# EAGLE board OOBDpiCAN (EAGLE 7.2.0)
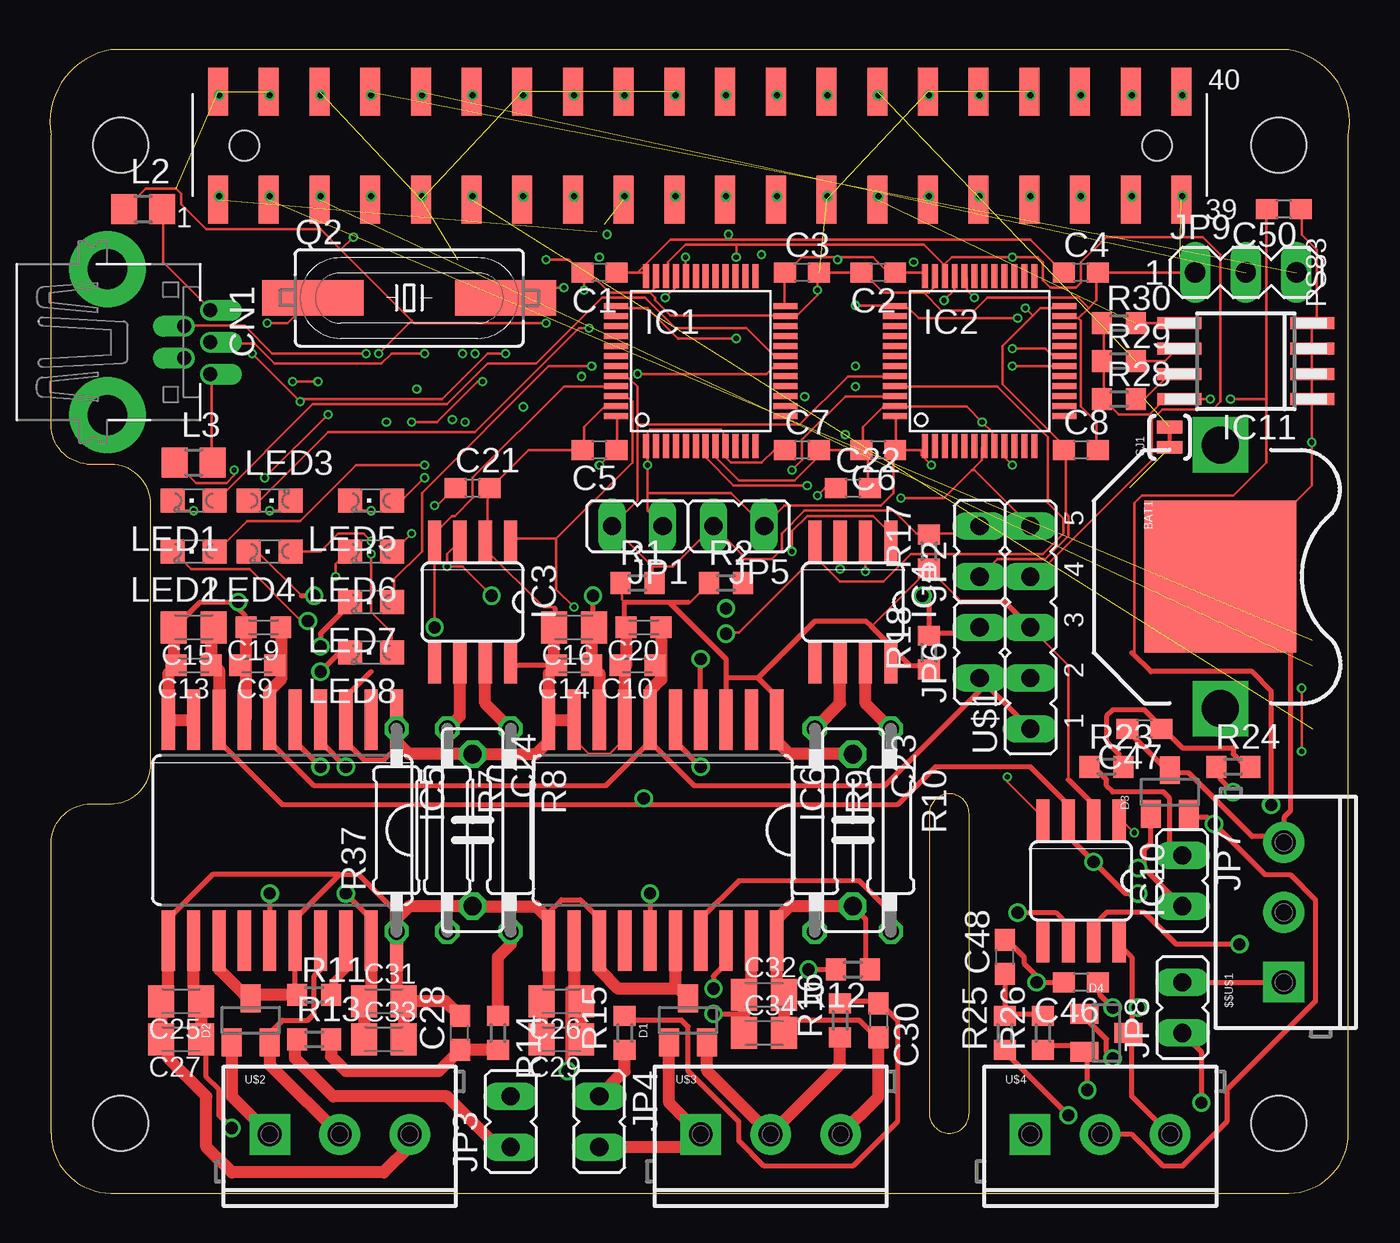
[diagram p3: board, top side]
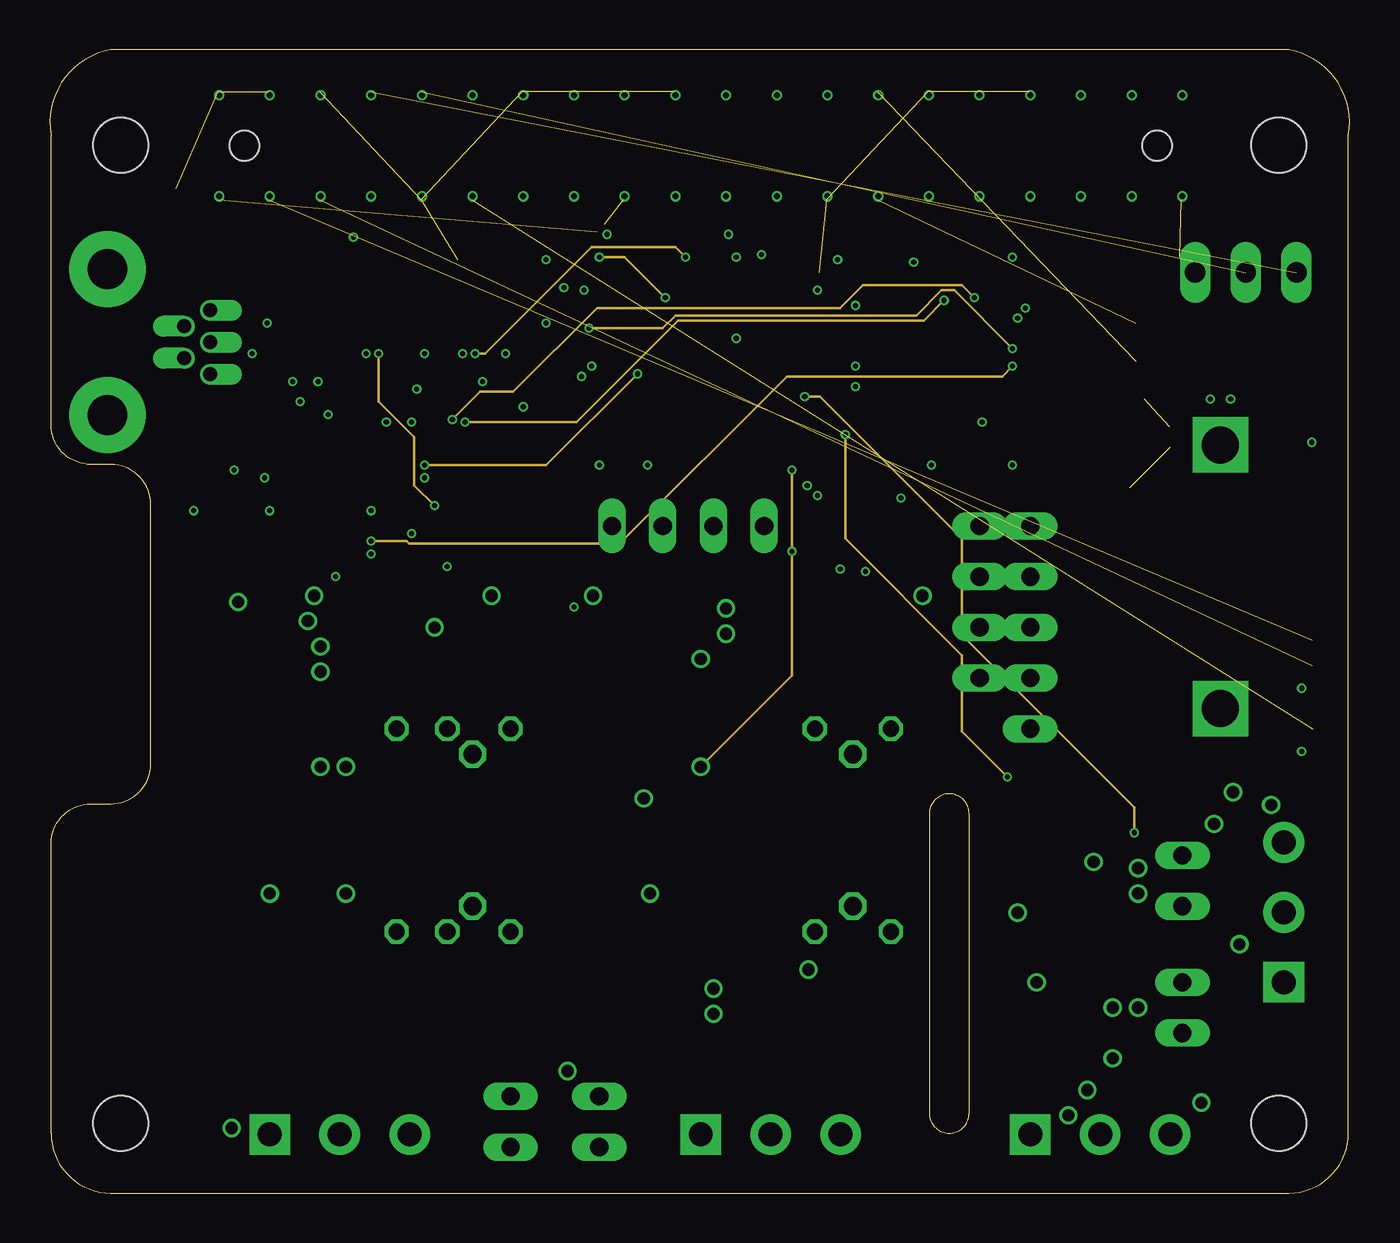
[diagram p4: board, inner layer Route2]
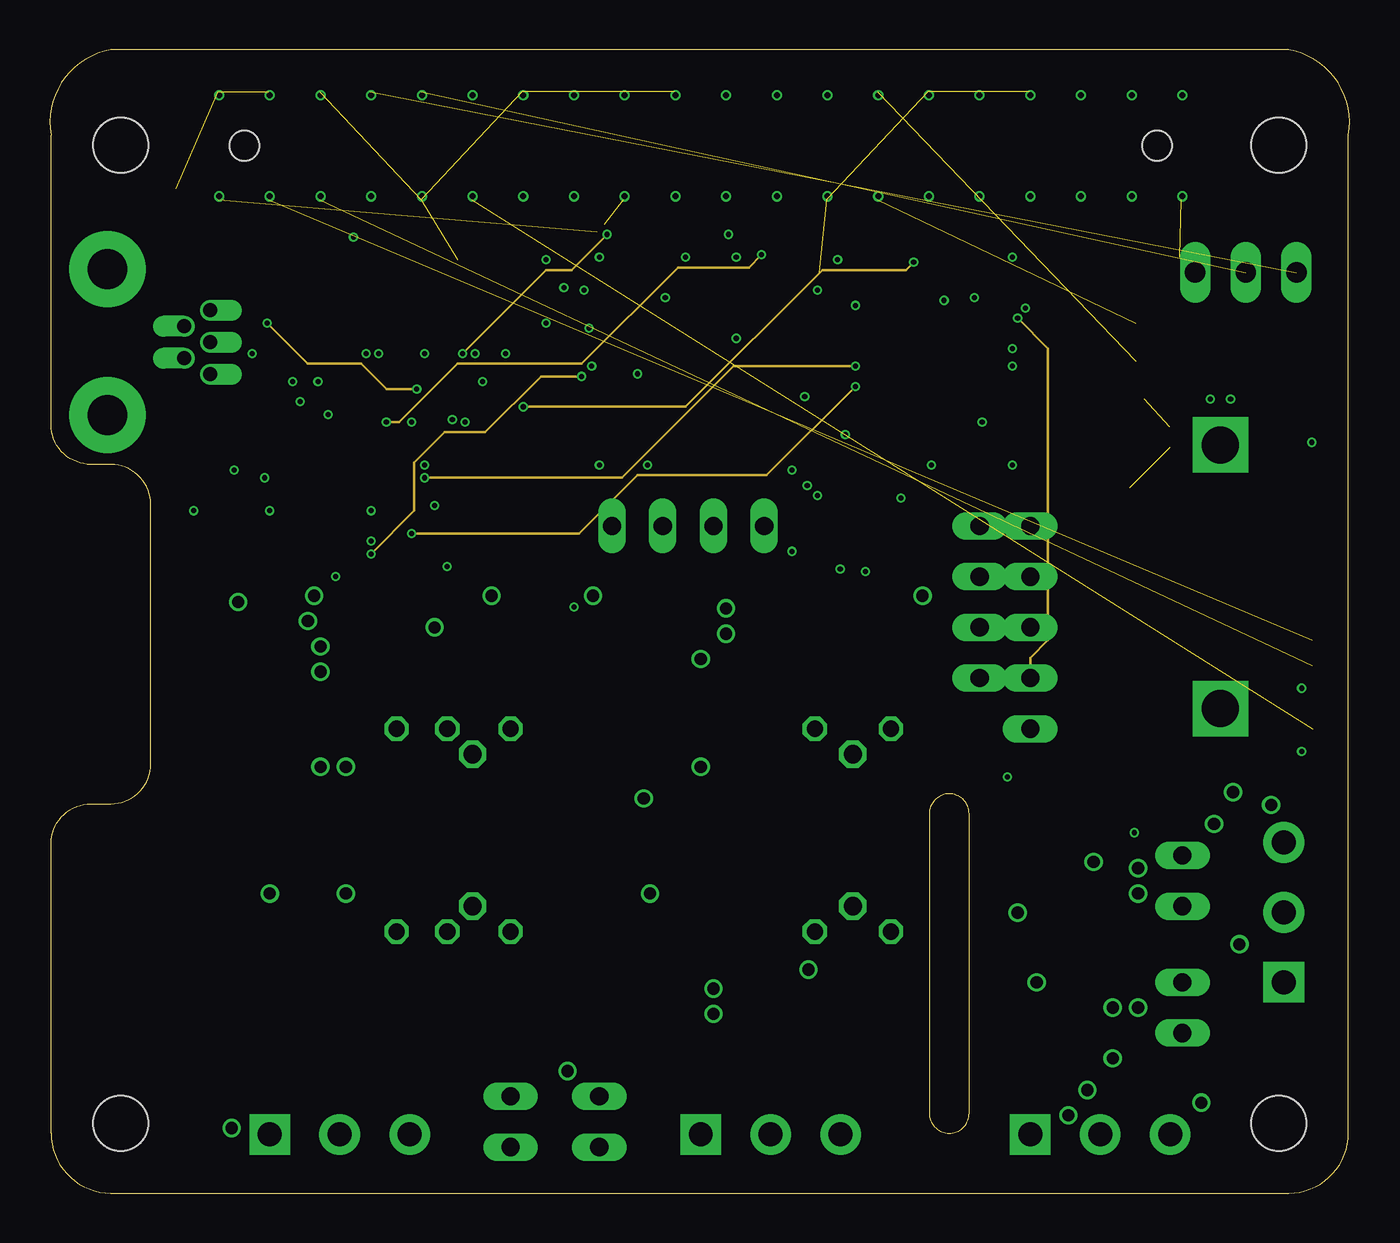
[diagram p5: board, inner layer Route15]
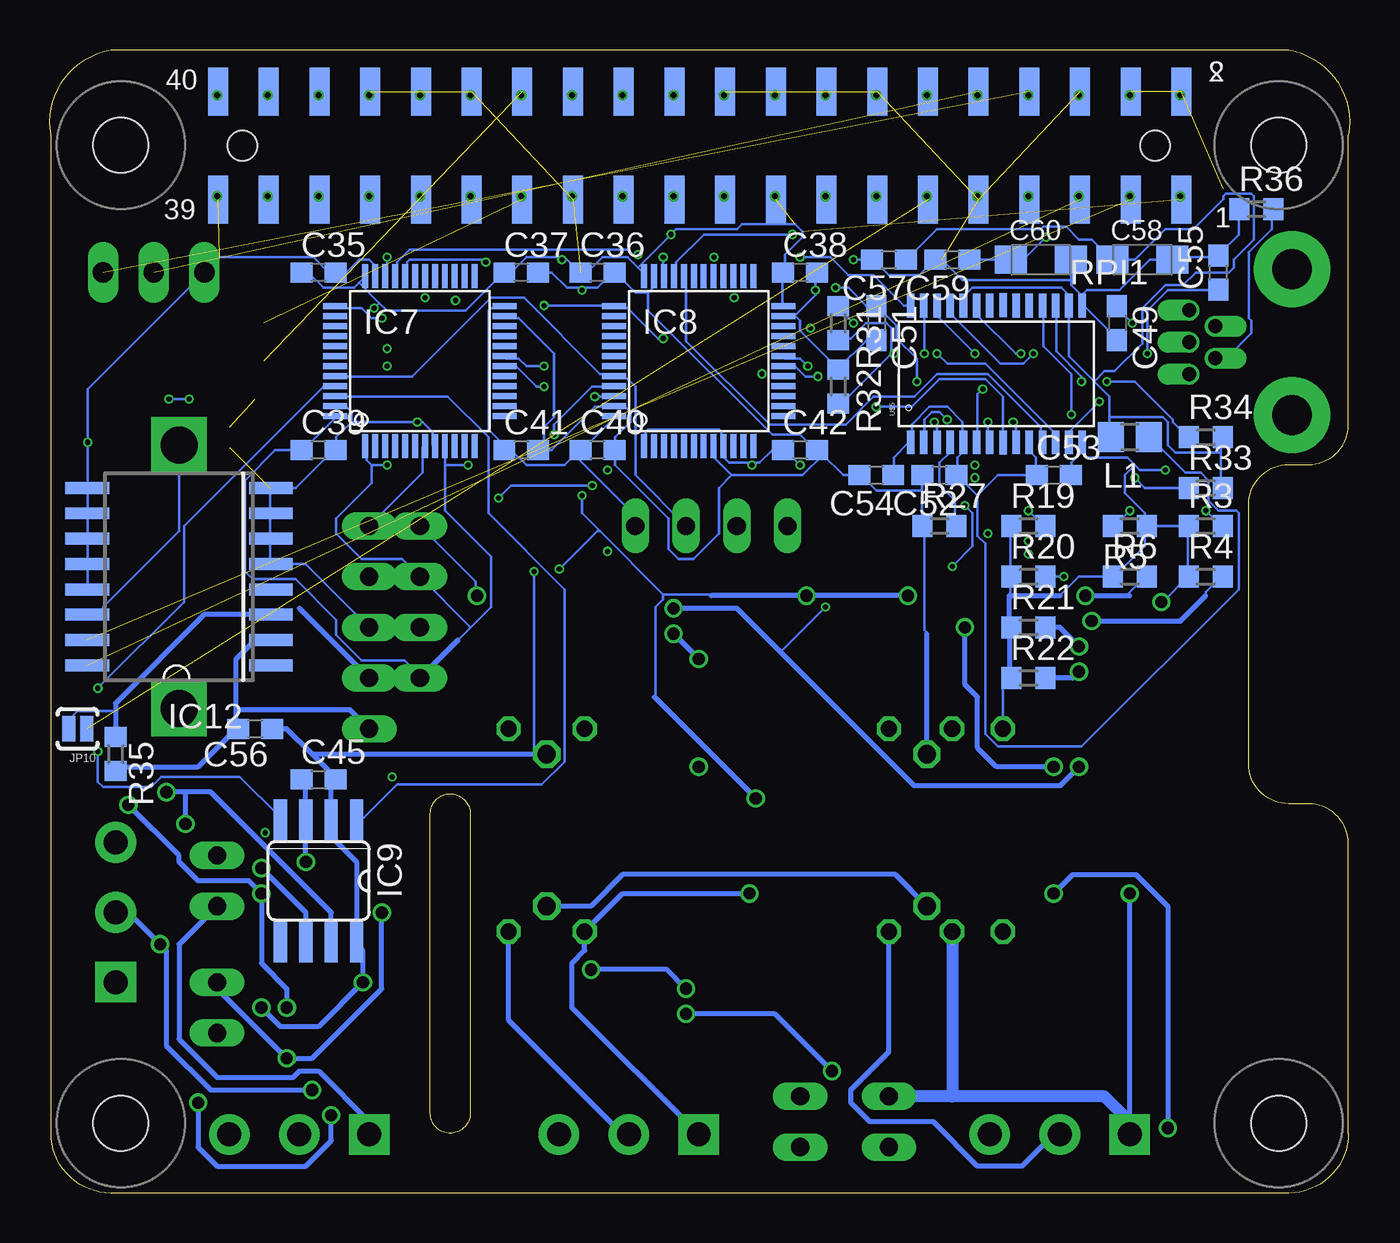
[diagram p6: board, bottom side, seen from below]

Size 65.11 x 57.27 mm. Coordinates in mm from the lower left corner, seen from the top.
Copper layers (1+2*15+16): Top 0.035559375mm / dielectric 0.17018125mm / Route2 0.01778125mm / dielectric 47mil / Route15 0.01778125mm / dielectric 0.17018125mm / Bottom 0.035559375mm
Design rules "OSHPark-4layer *": minimum track width 5mil, minimum drill 10mil, track to track 5mil, track to pad 5mil, pad to pad 5mil, via to via 5mil, smd to smd 5mil, copper to edge 15mil, drill to drill 6mil, minimum pad ring 4mil, minimum via ring 4mil, stop-mask expansion 2.5mil, vias tented up to drill 0mil, thermal gap 10mil
tKeepout: area 0.9,15 to 43.4,21.4
bKeepout: area 0.9,15 to 43.4,21.4

## Footprints (pad centres in the part's own frame; a part is rotated, then mirrored left to right if it is on the bottom)
SCREWTERMINAL-3.5MM-3 = drill 1.2 pad 2.032 square: 1 0,0 | drill 1.2 pad 2.032: 2 3.5,0; 3 7.008,0
BATTCON_12MM_PTH = smd 7.62 x 7.62: GND 0,0 | drill 1.854 square: VCC@1 -6.604,0; VCC@2 6.604,0
C0603 = smd 1.1 x 1: 1 -0.85,0; 2 0.85,0
C0603K = smd 1.05 x 1.08: 1 -0.875,0; 2 0.875,0
C0805K = smd 1.3 x 1.6: 1 -1,0; 2 1,0
C075-032X103 = drill 0.914 octagon: 1 -3.81,0; 2 3.81,0
SMC_A = smd 1.6 x 1.4: + -1.5,0; - 1.5,0
USB-MINIB-THM-MOLEX = drill 0.7 offset: D+ 0,9.72; D- -0.8,8.42; GND 1.6,9.72; ID 0.8,8.42; VBUS -1.6,9.72 | drill 2 pad 3.81: GND1 -3.65,4.57; GND4 3.65,4.57
SOT23 = smd 1 x 1.4: 1 -0.95,-1.1; 2 0.95,-1.1; 3 0,1.1
LQFP48 = smd 0.3 x 1.2: 1 -2.75,-4.25; 2 -2.25,-4.25; 3 -1.75,-4.25; 4 -1.25,-4.25; 5 -0.75,-4.25; 6 -0.25,-4.25; 7 0.25,-4.25; 8 0.75,-4.25; 9 1.25,-4.25; 10 1.75,-4.25; 11 2.25,-4.25; 12 2.75,-4.25; 25 2.75,4.25; 26 2.25,4.25; 27 1.75,4.25; 28 1.25,4.25; 29 0.75,4.25; 30 0.25,4.25; 31 -0.25,4.25; 32 -0.75,4.25; 33 -1.25,4.25; 34 -1.75,4.25; 35 -2.25,4.25; 36 -2.75,4.25 | smd 1.2 x 0.3: 13 4.25,-2.75; 14 4.25,-2.25; 15 4.25,-1.75; 16 4.25,-1.25; 17 4.25,-0.75; 18 4.25,-0.25; 19 4.25,0.25; 20 4.25,0.75; 21 4.25,1.25; 22 4.25,1.75; 23 4.25,2.25; 24 4.25,2.75; 37 -4.25,2.75; 38 -4.25,2.25; 39 -4.25,1.75; 40 -4.25,1.25; 41 -4.25,0.75; 42 -4.25,0.25; 43 -4.25,-0.25; 44 -4.25,-0.75; 45 -4.25,-1.25; 46 -4.25,-1.75; 47 -4.25,-2.25; 48 -4.25,-2.75
SO08 = smd 0.66 x 2.032: 1 -1.905,-3.073; 2 -0.635,-3.073; 3 0.635,-3.073; 4 1.905,-3.073; 5 1.905,3.073; 6 0.635,3.073; 7 -0.635,3.073; 8 -1.905,3.073
SO20W = smd 0.66 x 3.032: 1 -5.715,-5.529; 2 -4.445,-5.529; 3 -3.175,-5.529; 4 -1.905,-5.529; 5 -0.635,-5.529; 6 0.635,-5.529; 7 1.905,-5.529; 8 3.175,-5.529; 9 4.445,-5.529; 10 5.715,-5.529; 11 5.715,5.529; 12 4.445,5.529; 13 3.175,5.529; 14 1.905,5.529; 15 0.635,5.529; 16 -0.635,5.529; 17 -1.905,5.529; 18 -3.175,5.529; 19 -4.445,5.529; 20 -5.715,5.529
SOIC8 = smd 0.6 x 2.2: 1 -1.905,-3.33; 2 -0.635,-3.33; 3 0.635,-3.33; 4 1.905,-3.33; 5 1.905,3.33; 6 0.635,3.33; 7 -0.635,3.33; 8 -1.905,3.33
SOIC-16W = smd 0.6 x 2.2: 1 -4.445,-4.6; 2 -3.175,-4.6; 3 -1.905,-4.6; 4 -0.635,-4.6; 5 0.635,-4.6; 6 1.905,-4.6; 7 3.175,-4.6; 8 4.445,-4.6; 9 4.445,4.6; 10 3.175,4.6; 11 1.905,4.6; 12 0.635,4.6; 13 -0.635,4.6; 14 -1.905,4.6; 15 -3.175,4.6; 16 -4.445,4.6
JP1 = drill 0.914 long: 1 0,-1.27; 2 0,1.27
MA03-1 = drill 1.016 long: 1 -2.54,0; 2 0,0; 3 2.54,0
SJ_2S-NO = smd 0.635 x 1.27: 1 -0.45,0; 2 0.45,0
L0805 = smd 1.3 x 1.5: 1 -0.95,0; 2 0.95,0
CHIPLED_0805 = smd 1.2 x 1.2: A 0,-1.05; C 0,1.05
SM49 = smd 5.08 x 1.778: 1 -4.826,0; 2 4.826,0
R0603 = smd 1 x 1.1: 1 -0.85,0; 2 0.85,0
0207/10 = drill 0.813 octagon: 1 -5.08,0; 2 5.08,0
CONNECTOR_B+_SMT_HAT = smd 1 x 2.4 bottom: 1 -24.18,-2.7; 2 -24.18,2.7; 3 -21.64,-2.7; 4 -21.64,2.7; 5 -19.1,-2.7; 6 -19.1,2.7; 7 -16.56,-2.7; 8 -16.56,2.7; 9 -14.02,-2.7; 10 -14.02,2.7; 11 -11.48,-2.7; 12 -11.48,2.7; 13 -8.94,-2.7; 14 -8.94,2.7; 15 -6.4,-2.7; 16 -6.4,2.7; 17 -3.86,-2.7; 18 -3.86,2.7; 19 -1.32,-2.7; 20 -1.32,2.7; 21 1.22,-2.7; 22 1.22,2.7; 23 3.76,-2.7; 24 3.76,2.7; 25 6.3,-2.7; 26 6.3,2.7; 27 8.84,-2.7; 28 8.84,2.7; 29 11.38,-2.7; 30 11.38,2.7; 31 13.92,-2.7; 32 13.92,2.7; 33 16.46,-2.7; 34 16.46,2.7; 35 19,-2.7; 36 19,2.7; 37 21.54,-2.7; 38 21.54,2.7; 39 24.08,-2.7; 40 24.08,2.7 | drill 0.3: P$1 -24.13,-2.54; P$2 -24.13,2.54; P$3 -21.59,-2.54; P$4 -21.59,2.54; P$5 -19.05,-2.54; P$6 -19.05,2.54; P$7 -16.51,-2.54; P$8 -16.51,2.54; P$9 -13.97,-2.54; P$10 -13.97,2.54; P$11 -11.43,-2.54; P$12 -11.43,2.54; P$13 -8.89,-2.54; P$14 -8.89,2.54; P$15 -6.35,-2.54; P$16 -6.35,2.54; P$17 -3.81,-2.54; P$18 -3.81,2.54; P$19 -1.27,-2.54; P$20 -1.27,2.54; P$21 1.27,-2.54; P$22 1.27,2.54; P$23 3.81,-2.54; P$24 3.81,2.54; P$25 6.35,-2.54; P$26 6.35,2.54; P$27 8.89,-2.54; P$28 8.89,2.54; P$29 11.43,-2.54; P$30 11.43,2.54; P$31 13.97,-2.54; P$32 13.97,2.54; P$33 16.51,-2.54; P$34 16.51,2.54; P$35 19.05,-2.54; P$36 19.05,2.54; P$37 21.59,-2.54; P$38 21.59,2.54; P$39 24.13,-2.54; P$40 24.13,2.54 | smd 1 x 2.4: T1 -24.18,-2.7; T2 -24.18,2.7; T3 -21.64,-2.7; T4 -21.64,2.7; T5 -19.1,-2.7; T6 -19.1,2.7; T7 -16.56,-2.7; T8 -16.56,2.7; T9 -14.02,-2.7; T10 -14.02,2.7; T11 -11.48,-2.7; T12 -11.48,2.7; T13 -8.94,-2.7; T14 -8.94,2.7; T15 -6.4,-2.7; T16 -6.4,2.7; T17 -3.86,-2.7; T18 -3.86,2.7; T19 -1.32,-2.7; T20 -1.32,2.7; T21 1.22,-2.7; T22 1.22,2.7; T23 3.76,-2.7; T24 3.76,2.7; T25 6.3,-2.7; T26 6.3,2.7; T27 8.84,-2.7; T28 8.84,2.7; T29 11.38,-2.7; T30 11.38,2.7; T31 13.92,-2.7; T32 13.92,2.7; T33 16.46,-2.7; T34 16.46,2.7; T35 19,-2.7; T36 19,2.7; T37 21.54,-2.7; T38 21.54,2.7; T39 24.08,-2.7; T40 24.08,2.7 | hole 2.75: -29.05,-48.97; -29.05,0.03; 28.95,-48.97; 28.95,0.03 | hole 1.5: -22.86,0; 22.86,0
SJ_2S-TRACE = smd 0.635 x 1.27: 1 -0.508,0; 2 0.508,0
JP5 = drill 0.914 long: 1 1.27,1.27; 2 3.81,1.27; 3 6.35,1.27; 4 8.89,1.27; 5 11.43,1.27
TSSOP28 = smd 1.2 x 0.38: 1 -3.429,4.623; 2 -3.429,3.962; 3 -3.429,3.302; 4 -3.429,2.642; 5 -3.429,1.981; 6 -3.429,1.321; 7 -3.429,0.66; 8 -3.435,0; 9 -3.429,-0.66; 10 -3.429,-1.321; 11 -3.429,-1.981; 12 -3.429,-2.642; 13 -3.429,-3.302; 14 -3.429,-3.962; 15 3.429,-3.962; 16 3.429,-3.302; 17 3.429,-2.642; 18 3.429,-1.981; 19 3.429,-1.321; 20 3.429,-0.66; 21 3.435,0; 22 3.429,0.66; 23 3.429,1.321; 24 3.429,1.981; 25 3.429,2.642; 26 3.429,3.302; 27 3.429,3.962; 28 3.429,4.623

## Placement (x,y rotation side)
$$U$1  [SCREWTERMINAL-3.5MM-3]  61.81,10.56 90 top
BAT1  [BATTCON_12MM_PTH]  58.64,30.88 270 top
C1  100nF  [C0603]  27.52,46.12 180 top
C2  100nF  [C0603]  41.49,46.12 180 top
C3  100nF  [C0603]  37.68,46.12 0 top
C4  100nF  [C0603]  51.65,46.12 0 top
C5  100nF  [C0603]  27.52,37.23 180 top
C6  100nF  [C0603]  41.49,37.23 180 top
C7  100nF  [C0603]  37.68,37.23 0 top
C8  100nF  [C0603]  51.65,37.23 0 top
C9  10n  [C0603K]  10.38,26.43 180 top
C10  10n  [C0603K]  29.43,26.43 180 top
C13  100n  [C0603K]  7.2,26.43 180 top
C14  100n  [C0603K]  26.25,26.43 180 top
C15  10u  [C0805K]  7.2,28.34 180 top
C16  10u  [C0805K]  26.25,28.34 180 top
C19  100n  [C0603K]  10.7,28.34 180 top
C20  100n  [C0603K]  29.75,28.34 180 top
C21  100nF  [C0603]  21.17,35.32 0 top
C22  100nF  [C0603]  40.22,35.32 0 top
C23  NA (AY2221K29Y5SS63L7)  [C075-032X103]  40.22,18.18 270 top
C24  NA (AY2221K29Y5SS63L7)  [C075-032X103]  21.17,18.18 270 top
C25  100n  [C0805K]  6.57,9.61 180 top
C26  100n  [C0805K]  25.62,9.61 180 top
C27  10u  [C0805K]  6.57,7.7 180 top
C28  NA(10nF)  [C0603]  20.54,8.02 90 top
C29  10u  [C0805K]  25.62,7.7 180 top
C30  NA(10nF)  [C0603]  41.49,8.65 270 top
C31  10n  [C0805K]  16.73,9.61 0 top
C32  10n  [C0805K]  35.78,9.92 0 top
C33  100n  [C0805K]  16.73,7.7 0 top
C34  100n  [C0805K]  35.78,8.02 0 top
C35  100nF  [C0603]  51.65,46.12 0 bottom
C36  100nF  [C0603]  37.68,46.12 0 bottom
C37  100nF  [C0603]  41.49,46.12 0 bottom
C38  100nF  [C0603]  27.52,46.12 0 bottom
C39  100nF  [C0603]  51.65,37.23 0 bottom
C40  100nF  [C0603]  37.68,37.23 0 bottom
C41  100nF  [C0603]  41.49,37.23 0 bottom
C42  100nF  [C0603]  27.52,37.23 0 bottom
C45  100nF  [C0603]  51.65,20.72 0 bottom
C46  100nF  [C0603]  51.65,10.56 180 top
C47  NA(47nF)  [C0603]  54.83,23.26 180 top
C48  NA(10nF)  [C0603]  47.84,11.83 90 top
C49  33pF  [C0603]  11.65,43.58 270 bottom
C50  100nF  [C0603]  61.81,49.3 180 top
C51  33pF  [C0603]  23.71,43.58 270 bottom
C52  100nF  [C0603]  20.54,35.96 180 bottom
C53  100nF  [C0603]  14.82,35.96 0 bottom
C54  100nF  [C0603]  23.71,35.96 180 bottom
C55  1uF  [C0603]  6.57,46.12 90 bottom
C56  1uF  [C0603]  54.83,23.26 180 bottom
C57  100nF  [C0603]  23.08,46.75 180 bottom
C58  22uF/6.3V  [SMC_A]  10.38,46.75 0 bottom
C59  100nF  [C0603]  19.9,46.75 180 bottom
C60  22uF/6.3V  [SMC_A]  15.46,46.75 0 bottom
CN1  [USB-MINIB-THM-MOLEX]  -1.69,42.63 270 top
D1  PESD1CAN  [SOT23]  31.97,8.65 0 top
D2  PESD1CAN  [SOT23]  10.06,8.65 0 top
D3  PESD1CAN  [SOT23]  56.1,20.08 0 top
D4  PESD1CAN  [SOT23]  52.92,8.02 270 top
IC1  STM32F042CT  [LQFP48]  32.6,41.67 0 top
IC2  STM32F042CT  [LQFP48]  46.57,41.67 0 top
IC3  MCP2551SO8  [SO08]  21.17,29.61 180 top
IC4  MCP2551SO8  [SO08]  40.22,29.61 180 top
IC5  ADM3053M  [SO20W]  11.65,18.18 180 top
IC6  ADM3053M  [SO20W]  30.7,18.18 180 top
IC7  STM32F042CT  [LQFP48]  46.57,41.67 0 bottom
IC8  STM32F042CT  [LQFP48]  32.6,41.67 0 bottom
IC9  MCP2551SO8  [SO08]  51.65,15.64 180 bottom
IC10  MCP2551SO8  [SO08]  51.65,15.64 180 top
IC11  EEPROM24  [SOIC8]  59.91,41.67 90 top
IC12  DS3231  [SOIC-16W]  58.64,30.88 90 bottom
JP1  [JP1]  29.43,33.42 90 top
JP2  [JP1]  46.57,32.15 0 top
JP3  [JP1]  23.08,3.57 0 top
JP4  [JP1]  27.52,3.57 180 top
JP5  [JP1]  34.51,33.42 90 top
JP6  [JP1]  46.57,27.07 0 top
JP7  [JP1]  56.73,15.64 180 top
JP8  [JP1]  56.73,9.29 0 top
JP9  [MA03-1]  59.91,46.12 0 top
JP10  [SJ_2S-NO]  63.72,23.26 180 bottom
L1  2508056017Y2  [L0805]  11.01,37.87 180 bottom
L2  NA(2508056017Y2)  [L0805]  4.66,49.3 0 top
L3  2508056017Y2  [L0805]  7.2,36.59 0 top
LED1  yellow  [CHIPLED_0805]  7.2,34.69 90 top
LED2  green  [CHIPLED_0805]  7.2,32.15 90 top
LED3  yellow  [CHIPLED_0805]  11.01,34.69 270 top
LED4  green  [CHIPLED_0805]  11.01,32.15 90 top
LED5  yellow  [CHIPLED_0805]  16.09,34.69 90 top
LED6  green  [CHIPLED_0805]  16.09,32.15 90 top
LED7  yellow  [CHIPLED_0805]  16.09,29.61 90 top
LED8  green  [CHIPLED_0805]  16.09,27.07 90 top
Q2  12MHz  [SM49]  18,44.85 0 top
R1  510R  [R0603]  29.43,30.56 0 top
R2  510R  [R0603]  33.87,30.56 0 top
R3  120R  [R0603]  7.2,33.42 0 bottom
R4  120R  [R0603]  7.2,30.88 0 bottom
R5  120R  [R0603]  11.01,33.42 180 bottom
R6  120R  [R0603]  11.01,30.88 0 bottom
R7  0R  [0207/10]  19.9,18.18 270 top
R8  0R  [0207/10]  23.08,18.18 270 top
R9  0R  [0207/10]  38.32,18.18 270 top
R10  0R  [0207/10]  42.13,18.18 270 top
R11  8k2  [R0603]  13.24,9.92 0 top
R12  8k2  [R0603]  40.22,11.19 180 top
R13  60R  [R0603]  13.24,7.7 0 top
R14  60R  [R0603]  22.44,8.02 270 top
R15  60R  [R0603]  28.79,8.02 90 top
R16  60R  [R0603]  39.59,8.65 90 top
R17  510R  [R0603]  44.03,32.15 90 top
R18  510R  [R0603]  44.03,27.07 90 top
R19  120R  [R0603]  16.09,33.42 0 bottom
R20  120R  [R0603]  16.09,30.88 0 bottom
R21  120R  [R0603]  16.09,28.34 0 bottom
R22  120R  [R0603]  16.09,25.8 0 bottom
R23  60R  [R0603]  52.92,21.35 0 top
R24  60R  [R0603]  59.27,21.35 0 top
R25  60R  [R0603]  47.84,8.02 90 top
R26  60R  [R0603]  49.75,8.02 90 top
R27  680R  [R0603]  20.54,33.42 0 bottom
R28  10k  [R0603]  53.56,39.77 0 top
R29  10k  [R0603]  53.56,41.67 0 top
R30  10k  [R0603]  53.56,43.58 0 top
R31  10k  [R0603]  25.62,43.58 270 bottom
R32  NA(47k)  [R0603]  25.62,40.41 270 bottom
R33  10k  [R0603]  7.2,35.32 0 bottom
R34  10k  [R0603]  7.2,37.87 0 bottom
R35  10k  [R0603]  61.81,21.99 270 bottom
R36  10k  [R0603]  4.66,49.3 0 bottom
R37  0R  [0207/10]  17.36,18.18 90 top
RPI1  [CONNECTOR_B+_SMT_HAT]  32.6,52.47 0 top
SJ1  SOLDERJUMPERTRACE  [SJ_2S-TRACE]  56.1,37.87 90 top
U$1  [JP5]  50.38,21.99 90 top
U$2  [SCREWTERMINAL-3.5MM-3]  11.01,2.94 0 top
U$3  [SCREWTERMINAL-3.5MM-3]  32.6,2.94 0 top
U$4  [SCREWTERMINAL-3.5MM-3]  49.11,2.94 0 top
U$5  GL850G-31  [TSSOP28]  17.36,41.04 90 bottom

## Tracks (layer width: path | path; a pad name or v marks a point on that pad's centre or on a via)
+3V3  (via drill 0.25)  (2 unrouted)
  Top 0.127: IC1.48 28.41,38.88 28.41,37.23 C42.1 28.29,37.23 v27.52,36.47 | C7.1 36.29,37.23 35.65,36.59 34.13,36.59 33.87,36.85 33.87,37.36 IC1.9 33.75,37.48 33.75,38.12 33.62,38.25 30.06,38.25 29.94,38.12 29.94,37.48 IC1.1 29.94,37.36 v29.94,36.47 29.94,35.07 | 29.94,35.07 29.94,34.18 JP1.1 | 43.65,37.23 42.38,37.23 | 43.65,37.23 43.78,37.36 IC2.1 | 42.38,37.23 42.38,38.88 IC2.48 | 42.38,37.23 C41.1 42.26,37.23 42.26,35.07 41.62,34.44 36.8,34.44 JP5.1 34.13,35.07 29.94,35.07 | 29.43,46.12 29.68,46.12 29.81,45.99 IC1.36 | 29.43,46.12 C38.1 | 34,47.77 31.08,47.77 29.43,46.12 | 34,47.77 49.11,47.77 50.77,46.12 C4.1 | IC2.36 43.78,45.99 43.65,46.12 C37.1 42,46.12 41.24,46.88 39.46,46.88 | IC1.24 36.8,44.47 36.8,46.12 C3.1 36.92,46.12 37.68,46.88 39.46,46.88 | v39.46,46.75 39.46,46.88 | v34,48.02 34,47.77 | v48.23,36.47 47.84,36.85 47.84,37.36 IC2.9 | JP2.1 47.46,31.77 49.88,31.77 51.02,32.91 51.02,33.93 50.89,34.05 50.89,37.23 C8.1 50.77,37.23 50.77,37.48 47.72,40.53 47.72,42.44 49.24,43.96 | 49.24,43.96 49.62,44.34 50.77,44.34 IC2.24 | 49.24,43.96 v48.86,44.34 | 43.65,37.23 43.65,36.98 v44.16,36.47
  Top 0.254: IC5.6 11.01,22.62 13.24,20.4 27.84,20.4 30.06,22.62 | IC6.6 30.06,22.62 | U$1.1 46.89,25.48 | 30.06,22.62 32.29,20.4 41.81,20.4 46.89,25.48 | 46.89,25.48 JP6.1
  Top 0.406: C10.1 30.62,26.43 30.62,25.8 | C9.1 11.57,26.43
  Top 0.61: C19.1 11.57,26.43 11.57,25.72 11.01,25.16 IC5.6 | C20.1 30.62,25.8 30.62,25.72 30.06,25.16 IC6.6
  Bottom 0.127: 29.94,36.59 31.08,36.59 31.33,36.85 31.33,37.36 IC8.9 31.46,37.48 31.46,38.12 31.59,38.25 35.14,38.25 35.27,38.12 35.27,37.48 IC8.1 | 29.94,36.59 29.56,36.59 28.92,37.23 C42.1 28.29,37.23 v27.52,36.47 | v29.94,36.47 29.94,36.59 | C40.1 38.45,37.23 36.8,38.88 IC8.48 | 42.13,37.23 42,37.23 41.24,36.47 39.34,36.47 38.83,36.98 | 42.13,37.23 C41.1 42.26,37.23 | 38.83,36.98 38.57,37.23 C40.1 | 42.13,37.23 43.15,38.25 43.15,44.21 43.02,44.34 42.38,44.34 IC7.24 | 38.83,36.98 35.78,33.93 JP5.1 | 38.83,36.98 C40.1 | C35.1 52.16,46.12 51.4,45.36 49.88,45.36 49.62,45.61 | 49.62,45.61 49.37,45.87 IC7.36 | IC8.24 28.41,44.47 28.41,46.12 C38.1 28.29,46.12 28.29,47.01 27.4,47.9 27.4,48.15 27.78,48.53 30.45,48.53 30.7,48.28 33.75,48.28 v34,48.02 35.65,46.37 | 35.65,46.37 35.27,45.99 IC8.36 | 35.65,46.37 36.16,46.88 37.43,46.88 38.19,46.12 C36.1 38.57,46.12 39.34,46.88 39.46,46.88 | 39.46,46.88 41.24,46.88 42,46.12 C37.1 42.38,46.12 44.29,44.21 48.23,44.21 48.61,44.6 | 48.61,44.6 49.62,45.61 | 39.46,46.88 v39.46,46.75 | 48.99,36.47 v48.23,36.47 | 48.99,36.47 49.24,36.72 49.24,37.36 IC7.1 | 48.99,36.47 48.99,35.58 50.77,33.8 50.77,33.04 49.5,31.77 47.46,31.77 JP2.1 44.03,28.34 | IC7.48 50.77,38.88 52.42,37.23 C39.1 53.81,37.23 55.34,35.71 55.34,31.13 54.96,30.75 52.8,30.75 50.77,28.72 50.77,27.96 49.5,26.69 47.34,26.69 46.57,25.93 JP6.1 | 45.3,36.47 45.3,34.18 43.02,31.9 43.02,29.36 44.03,28.34 | 45.3,36.47 45.3,37.36 IC7.9 | 44.67,27.7 44.03,28.34 | v48.86,44.34 48.61,44.6 | 45.3,36.47 v44.16,36.47
  Bottom 0.254: 55.78,23.26 57.69,21.35 61.81,21.35 R35.2 | IC12.2 54.83,27.7 55.78,26.75 55.78,24.21 | 55.78,23.26 55.78,24.21 | 55.78,23.26 C56.2 | 44.67,27.7 JP6.1 | 55.78,24.21 50.07,24.21 U$1.1
+5V  (via drill 0.25, 0.61)  (2 unrouted)
  Top 0.127: v24.86,43.58 18.25,43.58 18.13,43.71 | 14.57,47.26 13.55,48.28 7.84,48.28 6.57,49.55 6.57,50.06 6.32,50.31 4.79,50.31 3.78,49.3 L2.1 | 14.57,47.26 18.13,43.71 | 18.13,43.71 v16.48,42.06 | 14.57,47.26 v15.21,47.9 | v19.27,34.44 19.4,34.44 20.29,35.32 C21.1 | IC3.3 20.54,32.66 19.9,32.02 v19.9,31.39 20.67,31.39 v22.13,29.93 | C22.1 38.83,35.32 v38.45,34.94 | v39.59,31.26 IC4.3 | 52.8,41.67 52.8,39.77 | 52.8,41.67 52.8,43.58 R30.1 | 52.8,41.67 R29.1 | 52.8,39.77 53.56,39.01 55.08,39.01 55.85,39.77 IC11.8 v58.13,39.77 | 52.8,39.77 R28.1 | 60.93,39.77 60.93,36.59 59.27,34.94 54.7,34.94 54.32,34.56 54.32,27.07 54.26,27.01 | 60.93,39.77 60.93,49.3 C50.2 | 60.93,39.77 v59.15,39.77
  Top 0.254: v27.21,29.93 27.21,28.34 C16.1 | v53.24,9.29 52.61,9.92 52.61,10.56 C46.1 | v54.51,15 53.88,15 v52.29,16.59 51.02,17.86 IC10.3 51.02,19.45 49.11,21.35 44.35,21.35 42.45,19.45 29.75,19.45 | IC5.8 8.47,22.62 11.65,19.45 29.75,19.45 | 29.75,19.45 v29.75,19.77 | 54.19,27.07 54.26,27.01 55.15,26.12 60.23,26.12 61.18,25.16 v61.18,19.45
  Top 0.61: C15.1 8.08,28.21 C13.1 8.47,26.2 IC5.8 | C16.1 27.13,28.21 C14.1 27.52,26.04 IC6.8
  Route2 0.127: v16.48,42.06 16.48,39.64 18.25,37.87 18.25,35.45 v19.27,34.44
  Bottom 0.127: C59.1 C60.+ 16.35,46.75 v15.21,47.9 | v24.86,43.58 25.62,44.34 R31.1 | v16.48,42.06 16.73,42.06 18.63,43.96 18.63,44.47 U$5.23 | v19.27,34.44 18.89,34.05 18.89,32.4 v19.9,31.39 | v38.45,34.94 38.45,34.05 37.56,33.17 | 34.38,29.99 37.56,33.17 | 34.38,29.99 31.97,29.99 31.97,29.93 | v39.59,31.26 37.68,33.17 37.56,33.17 | v59.15,39.77 v58.13,39.77 | 34.38,29.99 34.38,29.74 34.76,29.36 34.76,24.91 34.83,24.85
  Bottom 0.254: 31.97,29.93 v27.21,29.93 v22.13,29.93 | C45.1 52.29,20.72 IC9.3 v52.29,16.59 | v53.24,9.29 53.24,10.24 54.51,11.51 v54.51,15 55.15,15.64 57.69,15.64 58.64,16.59 58.64,16.91 v61.18,19.45 | v29.75,19.77 34.83,24.85
BOOT0  (via drill 0.61)
  Top 0.127: 30.19,31.39 30.19,30.63 R1.2 | 30.19,31.39 JP1.2 29.43,34.69 29.43,38.5 | 29.43,38.5 29.43,40.41 28.92,40.91 28.41,40.91 IC1.44 | 29.43,38.5 37.56,38.5 39.97,40.91 42.26,40.91 IC2.44 | 44.03,33.04 46.19,33.04 JP2.2 | 34.64,31.77 34.64,32.02 JP5.2 31.21,31.39 30.19,31.39 | 34.64,31.77 34.64,30.63 R2.2 | 44.03,33.04 43.4,33.04 42.26,34.18 37.81,34.18 36.67,33.04 36.67,32.28 36.16,31.77 34.64,31.77 | 44.03,33.04 R17.2
  Top 0.254: 44.03,28.02 46.26,28.02 JP6.2 | 44.03,28.02 44.03,29.61 v43.72,29.93 | 44.03,28.02 R18.2
  Bottom 0.127: JP2.2 43.78,30.63 43.78,29.99 v43.72,29.93 | JP5.2 35.78,35.96 35.78,40.41 36.29,40.91 36.8,40.91 IC8.44 36.92,41.04 37.56,41.04 41.37,44.85 43.02,44.85 46.96,40.91 50.77,40.91 IC7.44
CAN0-H
  Top 0.254: IC5.17 13.55,11.19 13.24,10.88 13.24,8.97 12.92,8.65 11.65,8.65 10.7,7.7 D2.2
  Top 0.61: D2.2 11.01,6.43 12.92,4.53 12.93,4.53 U$2.2 | R14.1 22.44,11.83 23.08,12.46 R8.2
  Bottom 0.254: R8.2 23.08,7.07 24.98,5.16 24.98,4.53 24.03,3.57 20.86,3.57 18.63,1.35 16.41,1.35 14.82,2.94 U$2.2
CAN0-L  (via drill 0.61)
  Top 0.254: v11.01,15 IC5.15
  Top 0.61: D2.1 9.11,4.84 U$2.1
  Bottom 0.254: U$2.1 v11.01,15
  Bottom 0.61: U$2.1 11.01,3.57 12.28,4.84 19.9,4.84 | 19.9,4.84 JP3.2 | R7.2 19.9,4.84
CAN0_RXD  (via drill 0.61)
  Top 0.127: IC1.45 28.29,40.41 25.75,40.41 21.17,35.83 21.17,34.82 20.29,33.93 20.16,33.93 19.27,33.04 IC3.4 v19.27,28.34
  Top 0.254: v14.82,21.35 13.55,22.62 IC5.4
  Bottom 0.254: v19.27,28.34 19.27,25.48 18.63,24.85 18.63,22.31 17.68,21.35 v14.82,21.35
CAN0_TXD  (via drill 0.25, 0.61)
  Top 0.127: 25.37,32.78 29.18,36.59 29.18,39.64 28.92,39.9 28.41,39.9 IC1.46 | 25.37,32.78 23.08,32.78 IC3.1 | 25.37,32.78 25.37,30.24 v26.25,29.36
  Top 0.254: v13.55,21.35 12.28,22.62 IC5.5
  Bottom 0.127: v26.25,29.36 28.51,27.1 28.54,27.07
  Bottom 0.254: v33.87,29.29 30.7,29.29 28.51,27.1 21.81,20.4 14.51,20.4 v13.55,21.35
CAN1-H
  Top 0.254: IC6.17 32.6,13.73 34.51,15.64 40.54,15.64 42.13,14.05 R10.2
  Top 0.61: D1.2 32.92,6.12 U$3.2 39.59,6.42 R16.1
  Bottom 0.254: R10.2 42.13,8.65 36.41,2.94 U$3.2
CAN1-L  (via drill 0.61)
  Top 0.254: v30.06,15 IC6.15
  Top 0.61: D1.1 31.02,4.52 U$3.1 31.97,2.3 JP4.2
  Bottom 0.254: U$3.1 38.95,9.29 38.95,11.51 38.32,12.15 R9.2 36.41,15 v30.06,15
CAN1_RXD  (via drill 0.61)
  Top 0.127: 38.32,31.9 39.59,30.63 41.75,30.63 43.15,32.02 49.75,32.02 50.77,33.04 50.77,33.8 50,34.56 50,37.87 47.46,40.41 42.38,40.41 IC2.45 | 38.32,31.9 IC4.4 38.32,32.66 | 38.32,31.9 34.51,28.09 33.87,28.09 v33.87,28.02
  Top 0.254: IC6.4 v32.6,26.75
  Bottom 0.254: v32.6,26.75 v33.87,28.02
CAN1_TXD  (via drill 0.25, 0.61)
  Top 0.127: v37.18,36.21 37.68,36.72 37.68,37.74 39.84,39.9 42.26,39.9 IC2.46 | IC4.1 42.13,33.04 41.24,33.93 37.94,33.93 37.18,33.17 v37.18,32.15
  Top 0.254: v32.6,21.35 31.33,22.62 IC6.5
  Route2 0.127: v37.18,36.21 v37.18,32.15 37.18,25.93 v32.6,21.35
CAN2-H  (via drill 0.61)
  Top 0.254: v59.27,20.08 58.64,20.72 58.64,21.35 R24.1 | D3.2 57.05,18.81 58,18.81 v58.32,18.5 60.86,15.96 62.13,15.96 63.4,14.69 63.4,9.61 58.96,5.16 58.96,3.57 56.73,1.35 55.78,1.35 54.19,2.94 U$4.2
  Bottom 0.254: 58.32,20.08 57.05,20.08 51.02,14.05 IC9.7 | 58.32,20.08 v59.27,20.08 | 58.32,20.08 v58.32,18.5
CAN2-L  (via drill 0.61)
  Top 0.254: 54.83,16.27 54.83,17.23 55.15,17.54 55.15,18.81 D3.1 | JP7.2 54.83,16.27 | 54.83,16.27 v54.51,16.27
  Bottom 0.254: IC9.6 52.29,14.05 v54.51,16.27 | U$4.1 49.11,3.57 51.65,6.11 52.61,6.11 52.92,5.8 56.73,5.8 58.64,7.7 58.64,12.46 JP7.2
CAN3-H  (via drill 0.61)
  Top 0.254: R26.1 49.75,7.38 51.65,7.38 D4.2 51.97,7.07 v51.97,5.16 | IC10.7 52.29,13.42 52.92,14.05 54.83,14.05 56.42,12.46 v59.59,12.46
  Bottom 0.254: v51.97,5.16 57.05,5.16 59.27,7.38 59.27,12.15 v59.59,12.46 61.18,14.05 $$U$1.2
CAN3-L  (via drill 0.61)
  Top 0.254: v53.24,6.75 52.92,7.07 52.92,7.7 51.97,8.65 D4.1 | IC10.6 51.02,13.42 50.38,14.05 v48.48,14.05 | JP8.2 $$U$1.1
  Bottom 0.254: JP8.2 56.73,10.24 v53.24,6.75 51.97,6.75 48.48,10.24 v48.48,14.05
GND  (via drill 0.25, 0.61)  (9 unrouted)
  Top 0.127: 40.73,37.23 40.99,36.98 40.99,35.32 C22.2 | IC1.8 33.37,37.36 33.37,36.85 34.51,35.71 37.3,35.71 38.45,36.85 38.45,37.23 C7.2 C41.2 40.73,37.23 | 40.73,37.23 40.73,38.37 41.75,39.39 42.26,39.39 IC2.47 42.38,39.39 45.94,39.39 v46.7,38.63 47.21,38.12 47.21,37.48 IC2.8 | 45.69,29.61 44.03,31.26 | 28.79,29.61 28.67,29.74 28.67,30.5 R1.1 | 31.97,29.61 32.1,29.61 32.99,30.5 R2.1 | 44.03,31.26 41.15,28.37 41.11,28.34 | 44.03,31.26 R17.1 | v40.86,31.13 IC4.2 | 51.02,20.72 51.02,26.43 U$1.3 | IC1.47 28.29,39.39 27.78,39.39 26.76,38.37 26.76,37.23 C42.2 23.97,37.23 22.06,35.32 C21.2 21.94,35.32 21.94,32.91 21.81,32.78 IC3.2 21.81,32.28 24.73,29.36 25.24,29.36 25.3,29.29 | v9.24,36.21 9.24,35.96 8.86,35.58 7.33,35.58 6.32,36.59 L3.1 | IC6.7 28.67,23.51 28.67,22.62 28.03,21.99 27.02,21.99 26.38,22.62 26.38,23.51 IC6.9 | 63.21,41.04 63.21,39.77 | C50.1 62.7,49.3 62.7,48.02 63.47,47.26 63.47,43.71 63.34,43.58 IC11.4 63.21,43.58 63.21,42.31 | 63.21,42.31 63.21,41.04 | 63.21,41.04 IC11.2 | 63.21,42.31 IC11.3 | 63.21,39.77 v63.21,37.61 63.21,35.45 BAT1.GND 62.13,27.39 | 63.21,39.77 IC11.1 | 51.53,43.83 51.65,43.71 51.65,39.39 52.42,38.63 52.42,37.23 C8.2 | 51.53,43.83 50.89,43.83 IC2.23 | 51.53,43.83 52.04,44.34 | 52.04,44.34 52.42,44.72 52.42,46.12 C4.2 JP9.1 | 26.76,46.12 27.02,46.12 28.03,45.1 30.06,45.1 | 30.06,45.1 30.32,45.36 30.32,45.87 IC1.35 | 43.78,45.1 41.75,45.1 40.73,46.12 C37.2 C3.2 38.45,46.12 v38.45,45.23 38.45,44.98 37.43,43.96 36.92,43.96 IC1.23 36.8,43.96 31.08,43.96 30.32,44.72 30.32,44.85 30.06,45.1 | 43.78,45.1 44.03,45.1 44.29,45.36 44.29,45.87 IC2.35
  Top 0.127: 26.76,46.12 v26.76,45.23 | 26.76,46.12 C38.2 26.64,46.12 26,46.75 v24.86,46.75 | 52.04,44.34 51.53,44.85 46.96,44.85 46.32,44.21 44.67,44.21 43.78,45.1
  Top 0.254: 56.1,21.04 54.19,22.94 54.19,23.26 C56.1 | 56.1,21.04 57.05,21.04 60.23,17.86 61.81,17.86 | 56.1,21.04 D3.3 | 61.81,17.86 61.81,18.81 62.13,19.13 62.13,27.39 | 61.81,17.86 $$U$1.3 | 9.43,29.29 9.11,29.61 7.52,29.61 6.25,28.34 C15.2 | 9.43,29.29 9.74,28.97 9.74,28.34 C19.2 | v9.43,29.61 9.43,29.29 | C14.2 23.08,26.43 IC3.8 | 24.98,28.34 C16.2 25.3,28.34 25.3,29.29 | R37.2 17.36,22.31 16.73,21.67 15.78,21.67 14.82,22.62 IC5.3 14.82,24.85 16.09,26.12 | 45.62,29.61 45.69,29.61 47.84,29.61 U$1.3 | IC10.2 52.29,19.45 51.02,20.72 | 43.08,26.43 42.13,26.43 IC4.8 | 43.08,26.43 44.03,26.43 R18.1 | 43.08,26.43 41.15,28.37 40.86,28.66 38.32,28.66 35.46,25.8 | 54.19,9.29 54.19,11.83 53.56,12.46 IC10.8 | 54.19,9.29 54.19,8.02 | 54.19,8.02 54.19,4.84 56.1,2.94 U$4.3 | 54.19,8.02 D4.3 | C20.2 28.79,28.34 28.79,29.61 31.02,29.61 | 31.02,29.61 31.97,29.61 | 33.87,25.8 33.87,26.75 31.02,29.61 | 33.87,25.8 IC6.3 | 49.75,10.56 C46.2 | 49.75,10.56 48.8,11.51 48.8,11.83 47.84,12.78 C48.2 | v49.43,10.56 49.75,10.56 | 35.46,25.8 33.87,25.8 | 35.46,25.8 36.41,24.85 IC6.1 | v54.51,9.29 54.19,9.29
  Top 0.406: C10.2 28.79,26.43 28.79,25.8 | C9.2 9.82,26.43 9.82,27.07
  Top 0.61: C23.1 37.05,21.99 36.41,22.62 IC6.1 | IC5.1 R37.2 17.36,22.62 18,21.99 C24.1 24.35,21.99 24.98,22.62 IC6.10 | IC6.10 IC6.9 | IC5.9 IC5.10 5.93,26.04 C13.2 6.2,26.56 C15.2 | IC5.7 9.82,23.79 9.82,27.07 C19.2 | IC6.10 24.98,26.04 C14.2 25.25,26.56 C16.2 | C20.2 28.87,26.43 28.79,26.36 28.79,25.8 IC6.7
  Bottom 0.127: 54.07,32.78 54.07,31.51 IC12.5 52.29,31.51 U$1.3 | 54.07,34.05 54.07,35.32 IC12.8 52.8,35.32 50.89,37.23 C39.2 50.77,37.23 50.77,37.87 50,38.63 | 54.07,34.05 54.07,32.78 | 54.07,32.78 IC12.6 | 54.07,34.05 IC12.7 | 50,38.63 50,39.13 50.26,39.39 50.77,39.39 IC7.47 | 50,38.63 v46.7,38.63 46.45,38.63 45.94,38.12 45.94,37.48 IC7.8 | 40.86,21.99 v40.86,31.13 | 36.8,37.23 36.8,37.87 36.03,38.63 36.03,39.13 36.29,39.39 36.8,39.39 IC8.47 36.92,39.39 37.81,39.39 39.97,37.23 40.35,37.23 | 40.35,37.23 C41.2 40.61,37.23 | 40.35,37.23 40.35,38.37 39.84,38.88 39.84,42.06 41.62,43.83 42.26,43.83 IC7.23 | 35.14,45.1 35.78,45.1 36.8,46.12 C36.2 36.92,46.12 37.68,45.36 38.45,45.36 | 35.14,45.1 34.89,45.36 34.89,45.87 IC8.35 | C37.2 39.97,46.12 39.21,45.36 38.45,45.36 | 21.43,35.2 21.43,35.96 C52.2 | 21.43,35.2 21.43,33.42 R27.1 21.3,33.42 21.3,28.21 21.17,28.09 21.17,28.02 | 26.38,36.98 26.64,37.23 C42.2 | 26.38,36.98 25.37,35.96 C54.2 24.48,35.96 23.71,35.2 21.43,35.2 | 30.95,35.96 31.84,36.85 31.84,37.36 IC8.8 | 30.95,35.96 27.4,35.96 26.38,36.98 | 26.38,36.98 C42.2 | 35.14,45.1 35.14,44.21 28.92,37.99 27.52,37.99 26.76,37.23 C42.2 | 36.8,37.23 36.8,36.47 34.13,33.8 34.13,32.28 33.62,31.77 32.86,31.77 31.59,33.04 31.59,35.32 30.95,35.96 | 36.8,37.23 C40.2 | 13.43,37.1 13.94,36.59 13.94,35.96 C53.2 | 13.43,37.1 13.43,37.61 U$5.14 13.43,37.1 | v9.24,36.21 10.51,36.21 10.76,36.47 | 10.76,36.47 11.14,36.85 13.17,36.85 13.43,37.1 | 8.09,30.88 9.36,29.61 v9.43,29.61 | 8.09,33.42 R5.1 10.25,33.42 | 8.09,33.42 8.09,30.88 | 8.09,30.88 R4.1 | 8.09,33.42 R3.1 | 14.51,29.93 13.55,30.88 R6.1 11.78,30.88 10.25,32.4 10.25,33.42
  Bottom 0.127: 16.98,29.93 16.98,30.88 | 16.98,30.88 16.98,33.42 R19.1 | 16.98,30.88 R20.1 | 10.76,36.47 11.27,35.96 11.27,35.07 10.25,34.05 10.25,33.42 | R37.2 17.36,25.55 17.11,25.8 R22.1 | 63.21,31.51 63.21,30.24 IC12.13 | 63.21,34.05 63.21,32.78 | 63.21,34.05 63.21,35.32 | 63.21,34.05 IC12.10 | 63.21,32.78 63.21,31.51 | 63.21,31.51 IC12.12 | 63.21,32.78 IC12.11 | IC7.35 48.86,45.99 48.86,46.5 49.11,46.75 49.62,46.75 50.26,46.12 C35.2 51.15,46.12 51.91,46.88 56.61,46.88 JP9.1 63.21,40.28 v63.21,37.61 63.21,35.32 | 63.21,35.32 IC12.9 | R36.1 5.55,49.3 5.55,48.02 6.57,47.01 C55.2 6.57,46.88 8.73,46.88 8.86,46.75 C58.- 10,46.75 11.52,45.23 13.17,45.23 13.43,44.98 | C49.2 11.65,42.82 13.3,44.47 U$5.15 | 13.94,45.74 13.94,45.48 13.43,44.98 | 13.94,45.74 13.94,46.75 C60.- | 13.43,44.98 13.43,44.47 U$5.15 | 13.94,45.74 19.4,45.74 20.41,46.75 C59.2 20.79,46.75 21.56,45.99 23.08,45.99 23.84,46.75 C57.2 v24.86,46.75 | 13.43,44.98 U$5.15 | 25.62,41.29 24.22,42.69 23.71,42.69 C51.2 | 27.78,43.96 26.76,44.98 v26.76,45.23 26.76,46.12 C38.2 | 27.78,43.96 28.29,43.96 IC8.23 27.78,43.96 | 25.62,41.29 27.52,43.2 27.52,43.71 27.78,43.96 | 25.62,41.29 R32.1 | v38.45,45.23 38.45,45.36
  Bottom 0.254: 17.05,28.34 17.05,25.8 R22.1 | 17.05,28.34 17.05,29.93 16.98,29.93 14.51,29.93 | 17.05,28.34 R21.1 | C24.1 21.17,28.02 | C56.1 53.24,23.26 51.97,21.99 | 51.97,21.99 50.7,20.72 C45.2 51.02,20.72 IC9.2 51.02,17.86 49.75,16.59 IC9.8 49.75,12.46 49.43,12.15 v49.43,10.56 51.65,8.34 53.56,8.34 v54.51,9.29 | 51.97,21.99 40.86,21.99 C23.1
GNDA
  Top 0.254: C23.2 40.86,13.73 40.86,11.19 R12.1 | 36.41,11.83 IC6.20 | 41.49,7.7 40.54,8.65 37.05,8.65 C34.2 | 27.52,11.83 IC6.13 27.52,13.73 26.57,14.69 25.62,14.69 24.98,14.05 IC6.11 | 12.28,9.92 IC5.16 12.28,13.73 14.51,15.96 | 14.51,15.96 15.46,15.96 17.36,14.05 R37.1 | IC5.11 5.93,13.73 8.16,15.96 14.51,15.96
  Top 0.61: 36.41,11.83 36.41,9.92 C32.2 C34.2 | C29.2 C26.2 24.98,10.29 IC6.11 24.98,13.73 24.35,14.37 C24.2 18,14.37 17.36,13.73 R37.1 IC5.20 17.36,9.92 C31.2 | IC5.11 5.93,10.29 C25.2 C27.2 5.93,7.34 5.93,6.75 7.84,4.84 7.84,2.3 9.11,1.03 16.73,1.03 18.02,2.33 U$2.3 | C31.2 C33.2 | C23.2 37.05,14.37 36.41,13.73 IC6.20 | R11.1 12.28,9.92 10.23,9.92 | 10.23,9.92 D2.3 | 10.23,9.92 9.74,9.92 8.47,11.19 IC5.13 | C28.2 19.8,9.61 C31.2 | IC6.16 31.33,10.39 D1.3 31.48,10.24 28.48,10.24 27.52,11.19 27.52,11.83 | U$3.3 41.49,4.82 41.49,7.7 C30.2
  Bottom 0.254: C23.2 38,14.37 36.41,15.96 22.76,15.96 C24.2
GPIO17  (1 unrouted)
ID_SC  (1 unrouted)
  Top 0.127: R29.2 55.85,41.67 56.48,42.31 IC11.6
ID_SD  (1 unrouted)
  Top 0.127: IC11.5 R30.2
INT-
  Bottom 0.127: 61.81,24.15 63.72,24.15 64.1,23.77 64.1,23.26 JP10.2
  Bottom 0.254: R35.1 61.81,24.15 61.81,24.53 57.37,28.97 IC12.3
N$1
  Top 0.406: IC5.18 14.82,11.19 14.19,10.56 14.19,10.03 R11.2
N$2  (via drill 0.25)
  Top 0.127: v25.75,45.36 23.33,45.36 Q2.2 | v18.13,38.63 19.4,38.63 21.43,40.66 v21.68,40.66
  Bottom 0.127: 23.71,44.47 24.22,44.47 25.11,45.36 v25.75,45.36 | v18.13,38.63 18.13,37.61 U$5.7 | v21.68,40.66 21.68,41.8 22.7,42.82 22.7,43.45 23.71,44.47 | 23.71,44.47 C51.1
N$3  (via drill 0.25)
  Top 0.127: v10.89,43.58 11.9,43.58 Q2.1
  Route15 0.127: v18.38,40.28 16.86,40.28 15.59,41.55 12.92,41.55 v10.89,43.58
  Bottom 0.127: v10.89,43.58 11.65,44.34 C49.1 | v18.38,40.28 18.63,40.02 18.63,37.61 U$5.6
N$4  (via drill 0.25)
  Top 0.127: LED5.A 17.62,34.69 v18.76,35.83
  Route15 0.127: v18.76,35.83 28.67,35.83 34.26,41.42 v40.35,41.42
  Bottom 0.127: v40.35,41.42 41.24,41.42 41.62,41.8 42.26,41.8 IC7.19
N$5  (1 unrouted)
  Top 0.127: R28.2 54.83,39.77 56.1,41.04 IC11.7
N$6
  Top 0.254: JP7.1 56.1,17.54 56.1,19.77 55.78,20.08 53.24,20.08 52.92,20.4 52.92,20.72 52.29,21.35 R23.1
N$7  (via drill 0.25)
  Top 0.127: v18.13,33.04 17.24,32.15 LED6.A
  Route15 0.127: v18.13,33.04 26.51,33.04 29.43,35.96 35.91,35.96 v40.35,40.41
  Bottom 0.127: v40.35,40.41 40.73,40.41 41.75,41.42 42.26,41.42 IC7.18
N$8  (via drill 0.25)
  Top 0.127: v16.09,34.18 15.59,34.18 15.08,34.69 LED5.C
  Bottom 0.127: v16.09,34.18 15.33,33.42 R19.2
N$9  (via drill 0.25)
  Top 0.127: v14.32,30.88 14.32,31.51 14.95,32.15 LED6.C
  Bottom 0.127: v14.32,30.88 R20.2
N$12  (via drill 0.61)
  Top 0.254: v38,11.19 R12.2 | v33.24,10.24 33.24,10.88 33.87,11.51 IC6.18
  Bottom 0.254: v38,11.19 34.19,11.19 v33.24,10.24
N$13  (via drill 0.61)
  Top 0.254: IC6.19 35.14,11.83 | v33.24,8.97 34.78,8.97 | v25.94,6.11 25.94,10.24 26.25,10.29
  Top 0.61: 35.14,11.83 35.14,9.92 C32.1 34.78,8.97 C34.1 | IC6.12 26.25,10.29 C26.1 C29.1
  Bottom 0.254: v33.24,8.97 28.79,8.97 v25.94,6.11
N$14
  Top 0.61: R7.1 20.54,23.89 IC3.6
N$15  (via drill 0.25)
  Top 0.127: v27.14,41.42 24.98,41.42 18.63,35.07 18.63,32.15 17.24,30.75 17.24,29.61 LED7.A
  Bottom 0.127: v27.14,41.42 27.52,41.8 28.29,41.8 IC8.19
N$16  (via drill 0.25)
  Top 0.127: v16.09,32.02 16.09,29.1 17.11,28.09 17.11,27.07 LED8.A
  Route15 0.127: v16.09,32.02 18.25,34.18 18.25,36.59 19.78,38.12 21.81,38.12 24.6,40.91 v26.64,40.91
  Bottom 0.127: v26.64,40.91 27.27,40.91 27.78,41.42 28.29,41.42 IC8.18
N$17  (via drill 0.61)
  Top 0.254: v13.55,27.39 13.55,28.02 15.14,29.61 LED7.C
  Bottom 0.254: R21.2 14.51,28.34 v13.55,27.39
N$18  (via drill 0.61)
  Top 0.254: v13.55,26.12 14.51,27.07 LED8.C
  Bottom 0.254: R22.2 13.87,25.8 v13.55,26.12
N$19
  Top 0.61: R8.1 21.81,24.53 IC3.7
N$20
  Top 0.254: 55.78,23.26 54.83,24.21 53.24,24.21 52.92,23.89 52.92,22.62 53.56,21.99 53.56,21.35 R23.2 | 55.78,23.26 56.73,22.31 59.27,22.31 59.27,21.99 59.91,21.35 R24.2 | 55.78,23.26 C47.1
N$21  (via drill 0.25)
  Top 0.127: v47.97,20.85 47.97,20.59 49.75,18.81 IC10.4
  Route2 0.127: v39.84,37.99 39.84,32.78 45.69,26.94 45.69,23.13 v47.97,20.85
  Bottom 0.127: v39.84,37.99 39.84,38.5 37.94,40.41 36.92,40.41 IC8.45
N$22
  Top 0.127: LED1.A 8.35,34.69 13.17,39.52 19.9,39.52 21.94,41.55 24.35,41.55 27.65,44.85 29.81,44.85 31.33,43.33 34.89,43.33 36.29,41.93 36.8,41.93 IC1.19
N$23  (via drill 0.25)
  Top 0.127: v18.76,36.47 15.33,36.47 12.54,33.67 9.87,33.67 8.35,32.15 LED2.A | v29.43,41.04 35.91,41.04 36.29,41.42 36.8,41.42 IC1.18
  Route2 0.127: v18.76,36.47 24.86,36.47 v29.43,41.04
N$24  (via drill 0.25)
  Top 0.127: v7.2,34.18 6.7,34.18 6.19,34.69 LED1.C
  Bottom 0.127: v7.2,34.18 6.44,33.42 R3.2
N$25  (via drill 0.61)
  Top 0.127: v12.92,28.66 12.92,28.72 12.54,28.72 10,31.26 7.08,31.26 6.19,32.15 LED2.C
  Bottom 0.127: 7.2,29.93 7.2,30.12 6.44,30.88 R4.2
  Bottom 0.254: 7.2,29.93 8.47,28.66 v12.92,28.66
N$26
  Top 0.61: R10.1 40.86,24.53 IC4.7
N$27
  Top 0.61: R9.1 39.59,24.53 IC4.6
N$28
  Top 0.61: JP4.1 28.79,6.11 R15.1
N$29  (via drill 0.25)
  Top 0.127: LED3.A 10.51,34.69 13.94,38.12 21.3,38.12 26.51,43.33 v27.02,43.33 | v48.23,42.31 49.88,42.31 50.26,41.93 50.77,41.93 IC2.19
  Route2 0.127: v27.02,43.33 30.7,43.33 31.33,43.96 43.4,43.96 44.67,45.23 45.3,45.23 v48.23,42.31
N$30  (via drill 0.25)
  Top 0.127: LED4.A 13.55,32.15 14.44,33.04 15.71,33.04 v16.09,32.66 | v48.23,41.42 50.77,41.42 IC2.18
  Route2 0.127: v16.09,32.66 17.87,32.66 18,32.53 28.54,32.53 36.92,40.91 47.72,40.91 v48.23,41.42
N$31  (via drill 0.25)
  Top 0.127: v11.01,34.18 11.52,34.18 12.03,34.69 LED3.C
  Bottom 0.127: v11.01,34.18 11.78,33.42 R5.2
N$32  (via drill 0.61)
  Top 0.127: LED4.C 10.38,32.15 12.6,29.93
  Top 0.254: 12.6,29.93 v13.24,29.93
  Bottom 0.127: R6.2 10.25,30.88 11.14,29.99 11.14,29.93
  Bottom 0.254: v13.24,29.93 11.14,29.93 11.01,29.93
N$33
  Bottom 0.127: C57.1 22.19,46.75 20.67,48.28 15.46,48.28 15.33,48.41 14.19,48.41 13.55,47.77 12.92,47.77 11.9,46.75 C58.+ 10.76,46.75 9.24,48.28 7.84,48.28 6.32,49.8 6.32,49.93 6.19,50.06 4.92,50.06 4.79,49.93 4.79,47.77 5.81,46.75 5.81,46.37 6.06,46.12 7.71,46.12 8.35,45.48 9.24,45.48 10.38,44.34 10.38,42.56 11.78,41.17 12.28,41.17 12.79,40.66 | 6.44,37.1 6.44,37.87 R34.2 | 6.44,37.1 6.44,35.32 R33.2 | U$5.24 19.27,44.47 19.27,44.98 18.89,45.36 14.44,45.36 14.06,44.98 U$5.16 14.06,41.93 12.79,40.66 | 12.03,38.88 12.03,39.9 12.79,40.66 | 12.03,38.88 12.03,37.87 L1.2 | 6.44,37.1 8.73,37.1 9.11,37.48 9.11,38.63 9.36,38.88 12.03,38.88
N$34  (via drill 0.25)
  Top 0.127: v13.94,39.01 v10.76,35.83
  Bottom 0.127: R33.1 10.25,35.32 v10.76,35.83 | v13.94,39.01 13.94,41.04 15.33,42.44 15.33,44.47 U$5.18
N$35  (via drill 0.25)
  Top 0.127: v13.43,40.66 v12.16,40.66
  Bottom 0.127: v12.16,40.66 10.76,40.66 8.86,38.75 8.86,38.63 8.09,37.87 R34.1 | v13.43,40.66 13.43,40.91 14.7,42.18 14.7,44.47 U$5.17
N$36  (via drill 0.25)
  Top 0.127: 12.41,39.77 v10.13,42.06 | v22.83,42.06 21.94,42.06 19.65,39.77 12.41,39.77 | 12.41,39.77 v12.54,39.64
  Bottom 0.127: 22.95,42.06 25.37,39.64 25.62,39.64 R32.2 | 22.95,42.06 22.95,43.33 23.21,43.58 24.22,43.58 24.98,42.82 25.62,42.82 R31.2 | v10.13,42.06 10.13,44.21 9.11,45.23 6.57,45.23 C55.1 | v12.54,39.64 14.06,38.12 U$5.13 | v22.83,42.06 22.95,42.06
N$37  (via drill 0.25)
  Top 0.127: v18.76,42.06 17.11,42.06 16.6,41.55 11.27,41.55 10.25,42.56 8.09,42.56 CN1.D+
  Bottom 0.127: U$5.26 20.67,43.96 v18.76,42.06
N$38  (via drill 0.25)
  Top 0.127: v15.84,42.06 11.14,42.06 9.74,43.45 6.82,43.45 CN1.D-
  Bottom 0.127: v15.84,42.06 16.35,41.55 17.49,41.55 19.9,43.96 19.9,44.47 U$5.25
N$39
  Bottom 0.127: C54.1 22.83,35.96 22.83,36.85 22.06,37.61 U$5.1 21.94,37.61 21.94,38.5 21.05,39.39 20.16,39.39 19.4,38.63 19.4,37.61 | 15.71,35.96 15.71,36.85 15.97,37.1 15.97,37.61 U$5.10 | 19.65,35.96 19.65,36.85 19.4,37.1 19.4,37.61 | 18.63,34.94 18.63,32.91 18.25,32.53 18.25,23.01 17.62,22.37 13.43,22.37 5.55,30.24 5.55,34.05 5.68,34.18 6.57,34.18 7.08,34.69 7.08,35.71 7.46,36.09 8.22,36.09 10,37.87 L1.1 | 19.65,35.96 18.63,34.94 | 19.65,35.96 C52.1 | 15.71,35.96 17.62,35.96 18.63,34.94 | 15.71,35.96 C53.1 | 19.4,37.61 U$5.5
N$40
  Bottom 0.127: R27.2 19.78,33.42 19.78,34.69 20.54,35.45 20.54,36.59 20.03,37.1 20.03,37.61 U$5.4
N$41
  Top 0.127: L3.2 8.09,36.59 8.09,40.91 CN1.GND
N$42
  Top 0.127: L2.2 5.68,49.3 5.68,46.63 7.97,44.34 CN1.VBUS
N$44
  Bottom 0.127: R36.2 3.9,49.3 3.9,48.28 5.05,47.14 5.05,43.83 4.92,43.71 4.92,43.07 6.06,41.93 6.7,41.93 CN1.ID
N$48
  Top 0.61: JP3.1 22.44,2.3 19.9,4.84 14.19,4.84 12.28,6.75 12.28,7.6 R13.1
N$49
  Top 0.254: 41.49,9.61 42.45,8.65 42.45,3.57 40.22,1.35 35.78,1.35 34.51,2.62 34.51,3.57 31.97,6.11 31.97,8.34 31.65,8.65 28.79,8.65 R15.2 | 41.49,9.61 39.59,9.61 R16.2 | 41.49,9.61 C30.1
N$53
  Top 0.61: R13.2 14.09,6.85 14.82,6.11 19.48,6.11 C28.1 R14.2
N$54  (via drill 0.25)
  Top 0.127: v54.32,18.05 53.56,18.81 IC10.1
  Route2 0.127: v37.81,39.9 38.57,39.9 45.69,32.78 45.69,27.96 54.32,19.32 v54.32,18.05
  Bottom 0.127: v37.81,39.9 36.92,39.9 IC8.46
N$56  (via drill 0.25)
  Top 0.127: v62.7,22.12 v62.7,25.29
  Bottom 0.127: v62.7,25.29 58.39,29.61 58.39,33.42 51.4,40.41 50.89,40.41 IC7.45 | v62.7,22.12 62.7,20.59 62.45,20.34 60.04,20.34 59.53,20.85 55.59,20.85 53.56,18.81 IC9.4
N$57
  Bottom 0.127: IC7.46 50.77,39.9 45.18,39.9 43.15,37.87 43.15,34.05 39.34,30.24 39.34,21.61 40.48,20.47 47.72,20.47 49.37,18.81 49.75,18.81 IC9.1
N$59  (via drill 0.61)
  Top 0.254: v51.02,3.89 47.84,7.07 R25.1 | v57.69,4.53 57.69,7.07 JP8.1
  Bottom 0.254: v51.02,3.89 51.02,2.62 52.29,1.35 56.73,1.35 57.69,2.3 v57.69,4.53
N$63
  Top 0.254: C48.1 47.84,8.97 | 47.84,8.97 49.75,8.97 R26.2 | 47.84,8.97 R25.2
N$65  (via drill 0.61)
  Top 0.254: v9.11,3.26 8.47,3.89 8.47,5.16 7.84,5.8 7.84,7.7 C27.1 | v14.82,15 16.09,13.73 IC5.19
  Top 0.61: IC5.12 7.2,10.29 C25.1 C27.1 | IC5.19 16.09,9.92 C31.1 C33.1
  Bottom 0.254: v9.11,3.26 9.11,14.37 10.7,15.96 13.87,15.96 v14.82,15
NRST  (via drill 0.25)
  Top 0.127: v37.94,35.45 34.26,35.45 32.86,36.85 32.86,37.36 IC1.7 | v42.64,34.82 44.8,34.82 46.19,36.21 | 46.19,36.21 46.7,36.72 46.7,37.36 IC2.7 | U$1.5 46.32,36.21 46.19,36.21
  Bottom 0.127: U$1.5 46.45,36.09 46.45,37.36 IC7.7 | v37.94,35.45 42,35.45 v42.64,34.82
RXD  (1 unrouted)
SCL  (1 unrouted)
SDA  (1 unrouted)
SWCLK  (via drill 0.25)
  Top 0.127: v34.38,42.82 31.46,42.82 29.94,44.34 28.41,44.34 IC1.37 | v40.35,44.47 42.26,44.47 IC2.37 42.38,44.34 43.02,44.34 43.53,43.83 v48.48,43.83
  Route15 0.127: U$1.2 49.11,26.82 50,27.7 50,42.31 v48.48,43.83
  Bottom 0.127: v34.38,42.82 34.64,42.82 36.16,44.34 36.8,44.34 IC8.37 36.92,44.47 v40.35,44.47 | v48.48,43.83 48.99,43.83 49.5,44.34 50.77,44.34 IC7.37
  Bottom 0.254: 52.61,29.29 U$1.2
SWDIO  (via drill 0.25)
  Top 0.127: 34.38,47.52 43.78,47.52 44.8,46.5 | 34.38,47.52 31.84,47.52 30.95,46.63 30.95,45.99 IC1.34 | 44.8,46.5 44.8,45.99 IC2.34 44.8,46.5 | 34.38,47.52 v34.38,46.88 | 44.8,46.5 45.18,46.88 v48.23,46.88 49.5,46.88 49.75,46.63 49.75,45.74 50.13,45.36 51.4,45.36 51.65,45.61 51.65,46.63 52.92,47.9 57.75,47.9 58.64,47.01 58.64,39.64 58.26,39.26 55.72,39.26 55.21,38.75 55.21,36.72 49.37,30.88 U$1.4
  Bottom 0.127: v34.38,46.88 34.38,45.99 IC8.34 | v48.23,46.88 48.23,45.99 IC7.34
TXD  (1 unrouted)
USB0_DM  (via drill 0.25)
  Top 0.127: v31.84,46.88 31.84,45.99 IC1.32
  Route2 0.127: v21.3,42.06 21.81,42.06 27.14,47.39 31.33,47.39 v31.84,46.88
  Bottom 0.127: v21.3,42.06 21.3,44.47 U$5.27
USB0_DP  (via drill 0.25)
  Top 0.127: v30.83,44.85 31.33,45.36 31.33,45.87 IC1.33
  Route2 0.127: v27.52,46.88 28.79,46.88 v30.83,44.85
  Bottom 0.127: U$5.28 22.32,44.47 23.84,45.99 25.11,45.99 26,46.88 v27.52,46.88
USB1_DM  (via drill 0.25)
  Top 0.127: v46.32,44.85 45.94,45.23 45.94,45.87 IC2.32
  Route2 0.127: v20.16,38.75 21.56,40.15 23.21,40.15 27.4,44.34 39.59,44.34 40.73,45.48 45.69,45.48 v46.32,44.85
  Bottom 0.127: v20.16,38.75 20.54,39.13 20.92,39.13 21.3,38.75 21.3,37.61 U$5.2
USB1_DP  (via drill 0.25)
  Top 0.127: v44.8,44.72 45.3,45.23 45.3,45.87 IC2.33
  Route2 0.127: v20.79,38.63 26.38,38.63 31.46,43.71 43.78,43.71 v44.8,44.72
  Bottom 0.127: U$5.3 20.67,38.5 v20.79,38.63
USB2_DM  (via drill 0.25)
  Route15 0.127: v23.71,39.39 31.84,39.39 38.7,46.25 42.89,46.25 v43.27,46.63
  Bottom 0.127: U$5.8 17.36,39.9 18.25,40.79 20.54,40.79 21.94,39.39 v23.71,39.39 | v43.27,46.63 43.4,46.63 43.53,46.75 47.08,46.75 47.21,46.63 47.21,45.99 IC7.32
USB2_DP  (via drill 0.25)
  Route15 0.127: v16.86,38.63 17.49,38.63 20.41,41.55 26.64,41.55 31.46,46.37 35.02,46.37 v35.65,47.01
  Bottom 0.127: v16.86,38.63 16.73,38.5 16.73,37.61 U$5.9 | v35.65,47.01 35.91,47.01 36.16,47.26 47.08,47.26 47.72,46.63 47.72,45.99 IC7.33
USB3_DM
  Bottom 0.127: U$5.11 15.46,37.61 15.46,38.37 18.13,41.04 20.67,41.04 21.81,39.9 23.84,39.9 25.24,38.5 29.05,38.5 33.24,42.69 33.24,45.87 IC8.32
USB3_DP  (via drill 0.25)
  Route15 0.127: v20.67,42.06 24.86,46.25 26.13,46.25 v27.91,48.02
  Bottom 0.127: v20.67,42.06 20.16,41.55 18.25,41.55 14.82,38.12 14.82,37.61 U$5.12 | v27.91,48.02 32.35,48.02 33.75,46.63 33.75,45.99 IC8.33
VBAT
  Bottom 0.127: BAT1.VCC@1 58.64,33.17 62.45,29.36 62.45,28.97 IC12.14
  Bottom 0.254: 62.45,28.97 IC12.14